# Altium schematic sheet L6.SchDoc
size A4
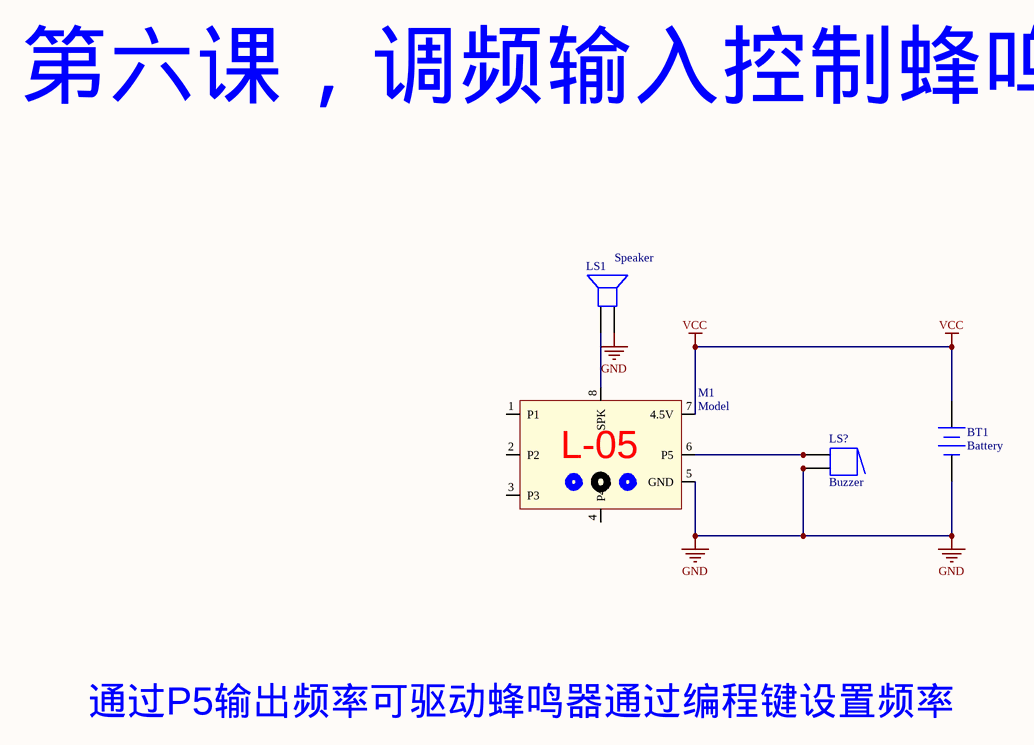
[diagram p0: L6.SchDoc]

## Parts
BT1  Battery  [BAT-2]
LS1  Speaker  [PIN2]
LS?  Buzzer  [ABSM-1574]
M1  Model

## Nets
GND: BT1.2(-) LS1.2 LS?.2 LS?.2A M1.5(GND)
VCC: BT1.1(+) M1.7(4.5V)
NetLS1_1: LS1.1 M1.8(SPK)
NetLS?_1: LS?.1 LS?.1A M1.6(P5)

Not connected (* = marked no-connect by the designer): M1 1(P1) 2(P2) 3(P3) 4(P4)

## Notes on the sheet
- Labels drawn without touching a wire or pin: L-05, 第六课，调频输入控制蜂鸣器, 通过P5输出频率可驱动蜂鸣器通过编程键设置频率

## Library data of the parts
BT1 = Battery: Multicell Battery; Published: 24-Mar-1999; LatestRevisionDate: 17-Jul-2002; LatestRevisionNote: Re-released for DXP Platform.; PackageReference: BAT-2; Publisher: Altium Limited; PackageDescription: Battery; 2 Leads
LS1 = Speaker: Loudspeaker; Published: 24-Mar-1999; LatestRevisionDate: 17-Jul-2002; LatestRevisionNote: Re-released for DXP Platform.; PackageReference: PIN2; Publisher: Altium Limited
LS? = Buzzer: Magnetic Transducer Buzzer; Published: 24-Mar-1999; LatestRevisionDate: 17-Dec-2003; LatestRevisionNote: Schematic revised, PCB Footprint replaced.; DatasheetVersion: 17-Dec-2003; PackageReference: ABSM-1574; Publisher: Altium Limited; PackageDescription: Magnetic Transducer Buzzer; ComponentLink1Description: Manufacturer Link; ComponentLink1URL: http://www.megastar.com/linecard/buzzmode/index.php
M1 = M?: 积木模块